# EAGLE design Washer Machine Status Inland ESP32 Through Hole (EAGLE 9.6.2)
AUTHOR: Eric Snis; REV: 1
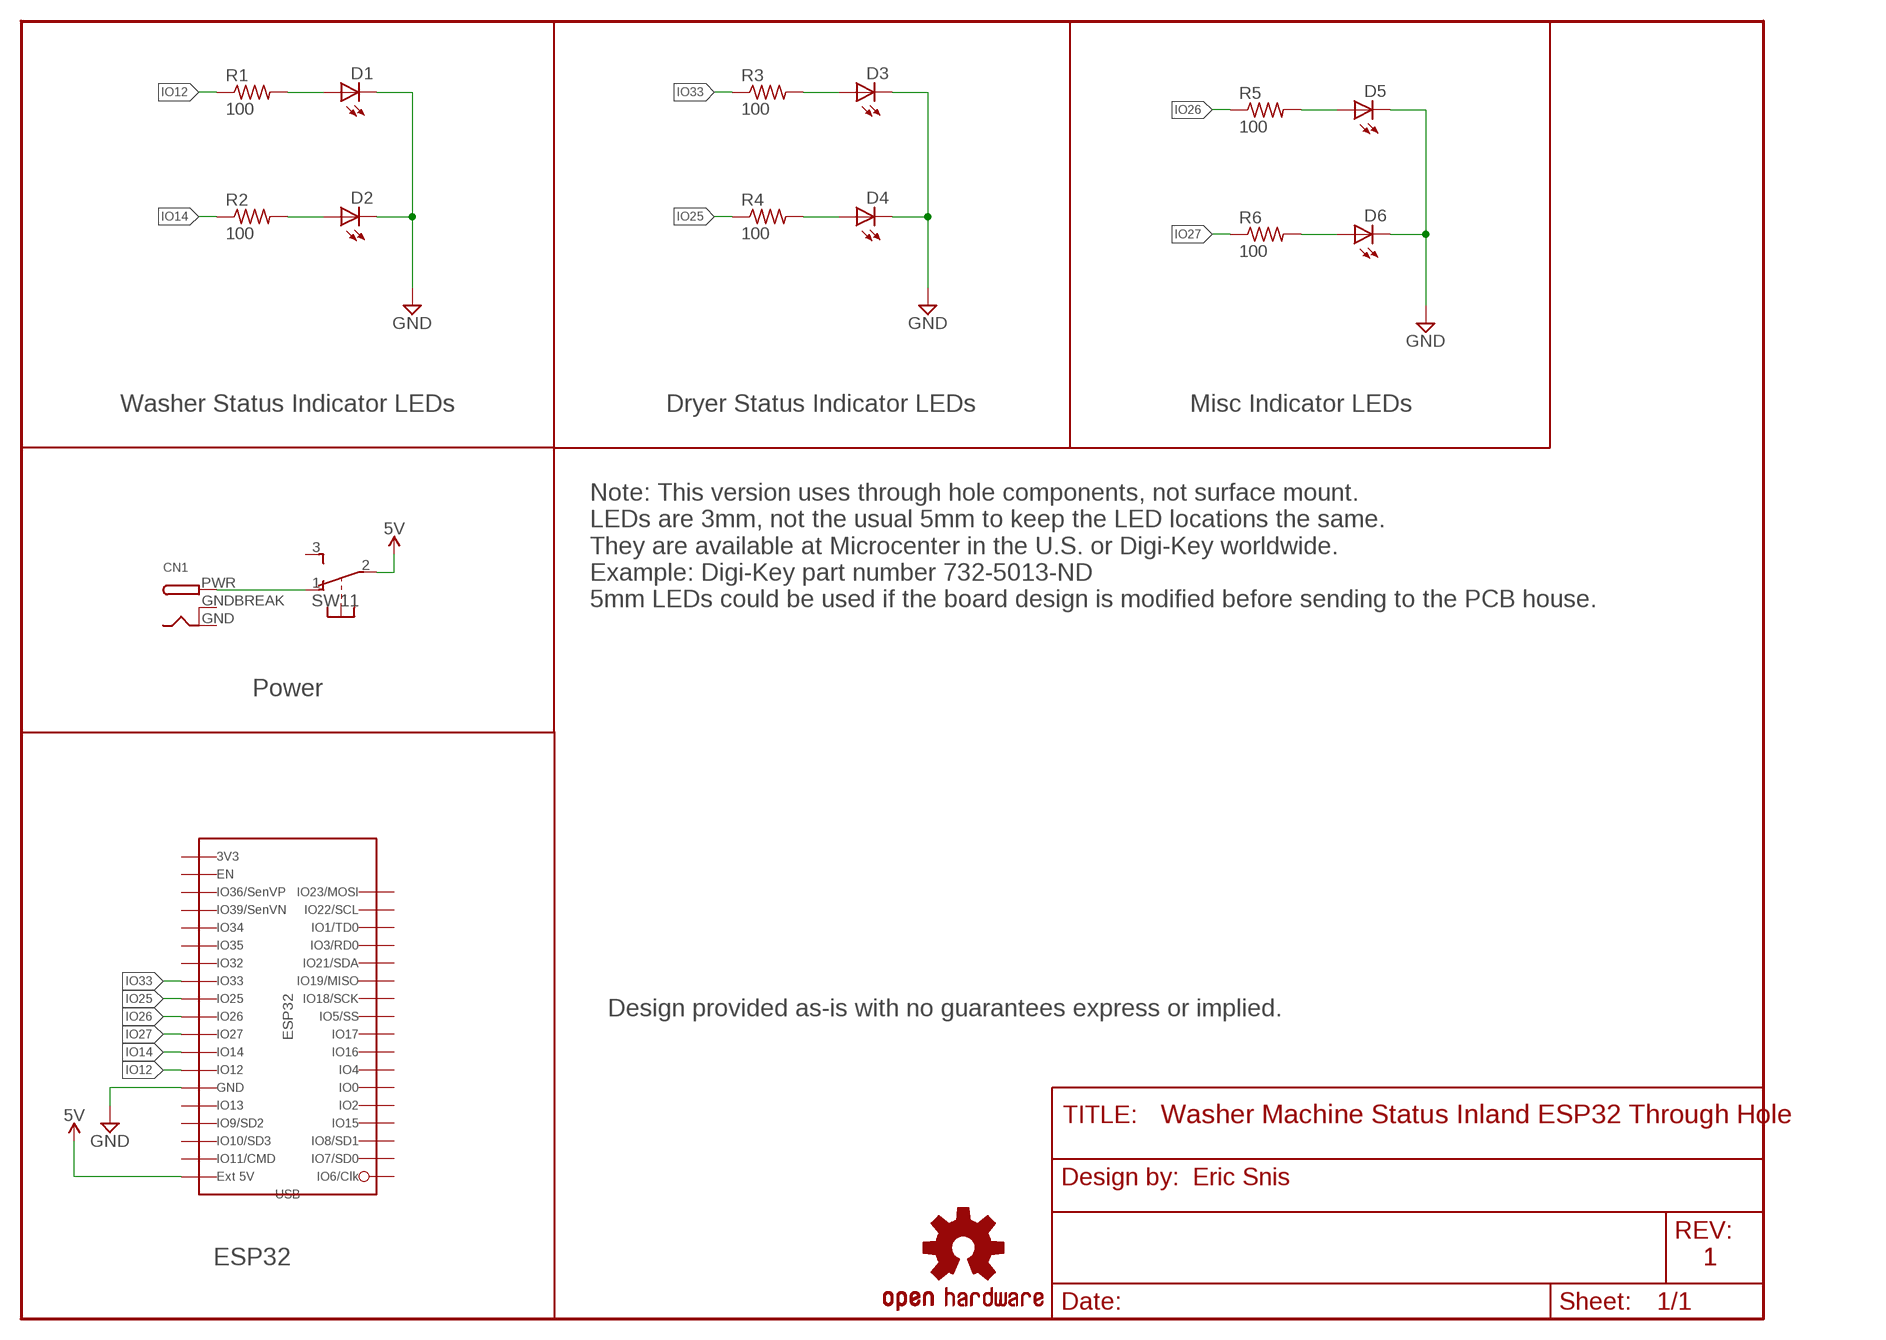
[diagram p0: schematic, sheet 1]

## Parts
CN1  DCBARRELPTH  [DCJACK_2MM_PTH]
D1  Green  LED3MM  [LED3MM]
D2  Red  LED3MM  [LED3MM]
D3  Green  LED3MM  [LED3MM]
D4  Red  LED3MM  [LED3MM]
D5  Green  LED3MM  [LED3MM]
D6  Red  LED3MM  [LED3MM]
LOGO2  OSHW-LOGOMINI  [OSHW-LOGO-MINI]
R1  100  R-US_0204/7  [0204/7]
R2  100  R-US_0204/7  [0204/7]
R3  100  R-US_0204/7  [0204/7]
R4  100  R-US_0204/7  [0204/7]
R5  100  R-US_0204/7  [0204/7]
R6  100  R-US_0204/7  [0204/7]
SW1  EG1213  [EG1213]
U$3  ESP32-INLAND  [ESP32_INLAND]

## Nets
5V: SW1.2(1:P) U$3.5V(EXT_5V)
GND: D1.K(C) D2.K(C) D3.K(C) D4.K(C) D5.K(C) D6.K(C) U$3.GND1 U$3.GND2(GND1) U$3.GND(GND1)
IO12: R1.1 U$3.IO12
IO14: R2.1 U$3.IO14
IO25: R4.1 U$3.IO25
IO26: R5.1 U$3.IO26
IO27: R6.1 U$3.IO27
IO33: R3.1 U$3.IO33
N$1: CN1.PWR SW1.1(1:O)
N$2: D5.A R5.2
N$3: D1.A R1.2
N$4: D2.A R2.2
N$5: D3.A R3.2
N$6: D4.A R4.2
N$7: D6.A R6.2
Unconnected: SW1.3(1:S) SW1.MT1(MT) SW1.MT2(MT) U$3.CLK U$3.CMD(IO11/CMD) U$3.EN U$3.IO0 U$3.IO2 U$3.IO4 U$3.IO5 U$3.IO13 U$3.IO15 U$3.IO16 U$3.IO17 U$3.IO18 U$3.IO19 U$3.IO21(IO21/SDA) U$3.IO22 U$3.IO23(IO23/SCL) U$3.IO32 U$3.IO34 U$3.IO35 U$3.RXD0 U$3.SD0 U$3.SD1 U$3.SD2(IO9/SD2) U$3.SD3(IO10/SD3) U$3.SVN(IO39/SVN) U$3.SVP(IO36/SVP) U$3.TXD0

## Notes on the sheet
- Washer Status Indicator LEDs | Dryer Status Indicator LEDs | Misc Indicator LEDs
- Note: This version uses through hole components, not surface mount.
  LEDs are 3mm, not the usual 5mm to keep the LED locations the same.
  They are available at Microcenter in the U.S. or Digi-Key worldwide.
  Example: Digi-Key part number 732-5013-ND
  5mm LEDs could be used if the board design is modified before sending to the PCB house.
- Power
- Design provided as-is with no guarantees express or implied.
- ESP32

## Power pins joined to a net without a drawn wire
3V3: U$3.3V3
GND: CN1.GND
GNDBREAK: CN1.GNDBREAK

## Library data of the parts
CN1 = connectors:DCBARREL: 2.0mm DC Barrel Jack DCJACK_2MM_PTH - Through Hole Jack (4UConnector: 05537)
D1-D6 = adafruit:LED: LED OSRAM: - CHIPLED LG R971, LG N971, LY N971, LG Q971, LY Q971, LO R971, LY R971 LH N974, LH R974 LS Q976, LO Q976, LY Q976 LO Q996 - Hyper CHIPLED LW Q18S LB Q993, LB Q99A, LB R99A - SideLED LS A670, LO A670, LY A670, LG A670, LP A670 LB A673, LV A673, LT A673, LW A673 LH A674 LY A675 LS A676, LA A676, LO A676, LY A676, LW A676 LS A679, LY A679, LG A679 - Hyper Micro SIDELED® LS Y876, LA Y876, LO Y876, LY Y876 LT Y87S - SmartLED LW L88C, LW L88S LB L89C, LB L89S, LG L890 LS L89K, LO L89K, LY L89K LS L896, LA L896, LO L896, LY L896 - TOPLED LS T670, LO T670, LY T670, LG T670, LP T670 LSG T670, LSP T670, LSY T670, LOP T670, LYG T670 LG T671, LOG T671, LSG T671 LB T673, LV T673, LT T673, LW T673 LH T674 LS T676, LA T676, LO T676, LY T676, LB T676, LH T676, LSB T676, LW T676 LB T67C, LV T67C, LT T67C, LS T67K, LO T67K, LY T67K, LW E67C LS E67B, LA E67B, LO E67B, LY E67B, LB E67C, LV E67C, LT E67C LW T67C LS T679, LY T679, LG T679 LS T770, LO T770, LY T770, LG T770, LP T770 LB T773, LV T773, LT T773, LW T773 LH T774 LS E675, LA E675, LY E675, LS T675 LS T776, LA T776, LO T776, LY T776, LB T776 LHGB T686 LT T68C, LB T68C - Hyper Mini TOPLED® LB M676 - Mini TOPLED Santana® LG M470 LS M47K, LO M47K, LY M47K Source: http://www.osram.convergy.de/
LOGO2 = SparkFun-Aesthetics:OSHW-LOGO: Open-Source Hardware (OSHW) Logo This logo indicates the piece of hardware it is found on incorporates a OSHW license and/or adheres to the definition of open source hardware found here: http://freedomdefined.org/OSHW
R1-R6 = adafruit:R-US_: RESISTOR, American symbol
SW1 = adafruit:EG1213: E-Switch right-angle slide SPDT Part #EG1213 http://www.ladyada.net/library/eagle
U$3 = connectors:ESP32: ESP-32-Dev ESP32 from Inland/Microcenter

## Board
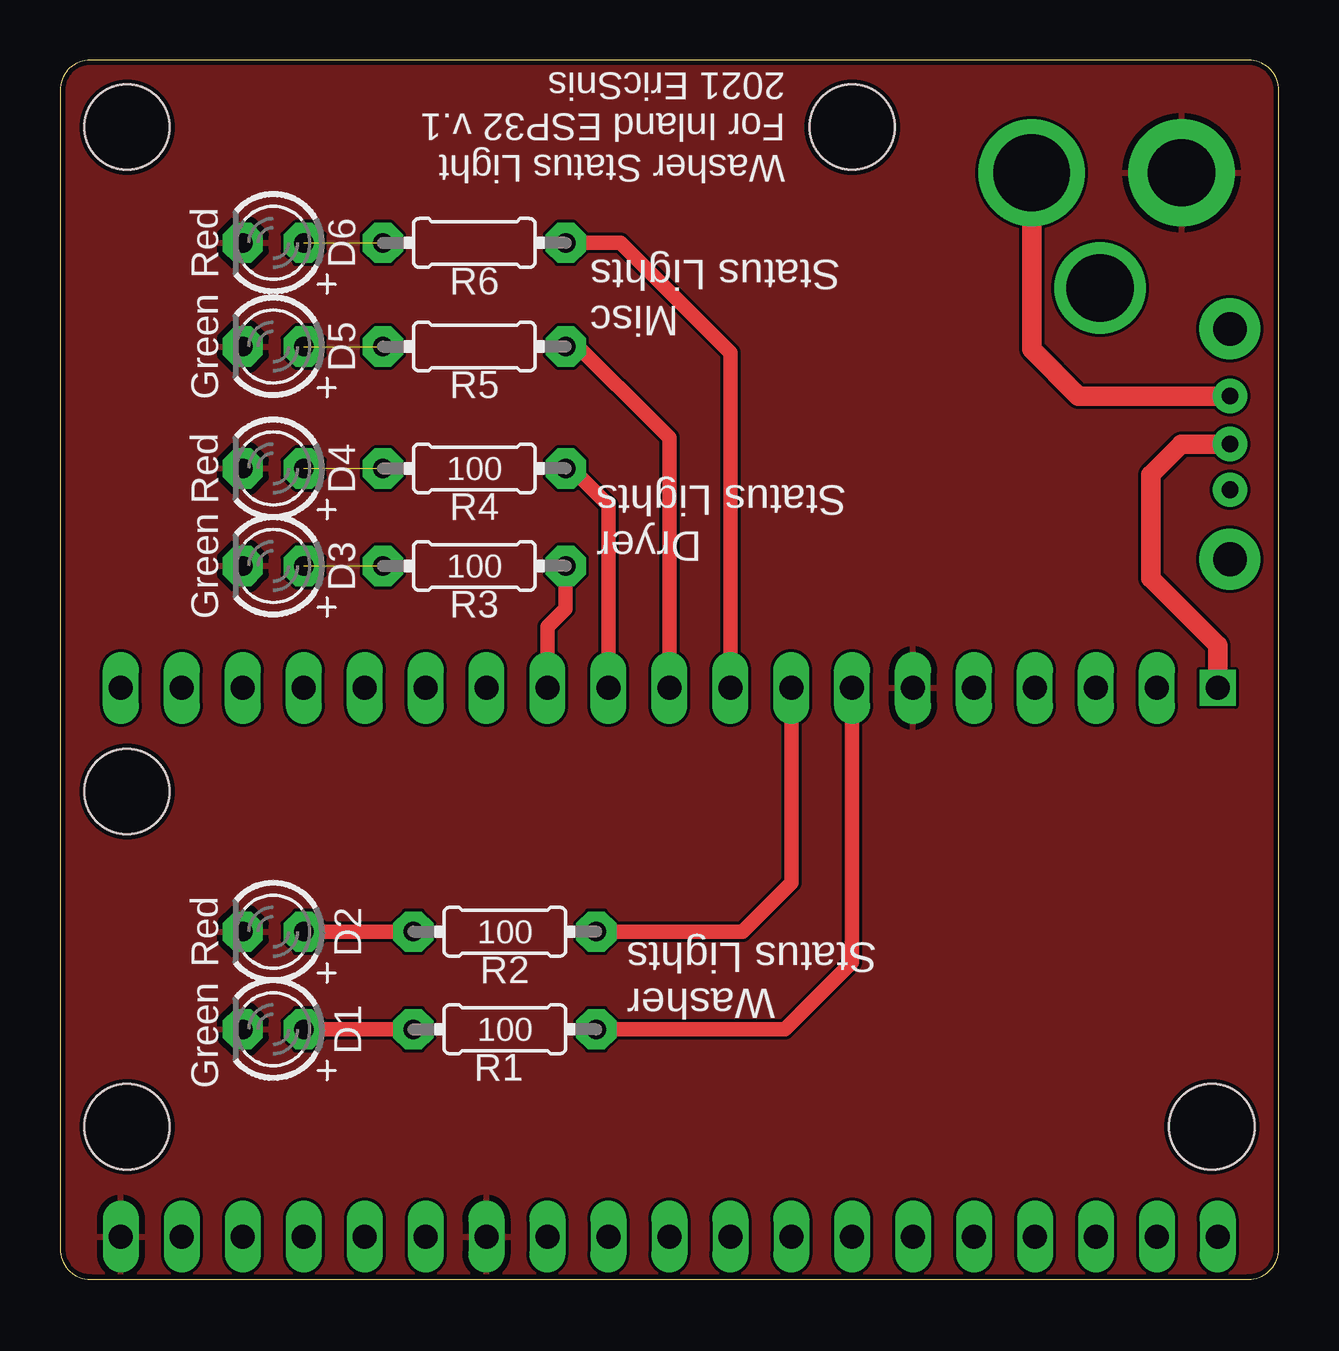
[diagram p1: board, top side]
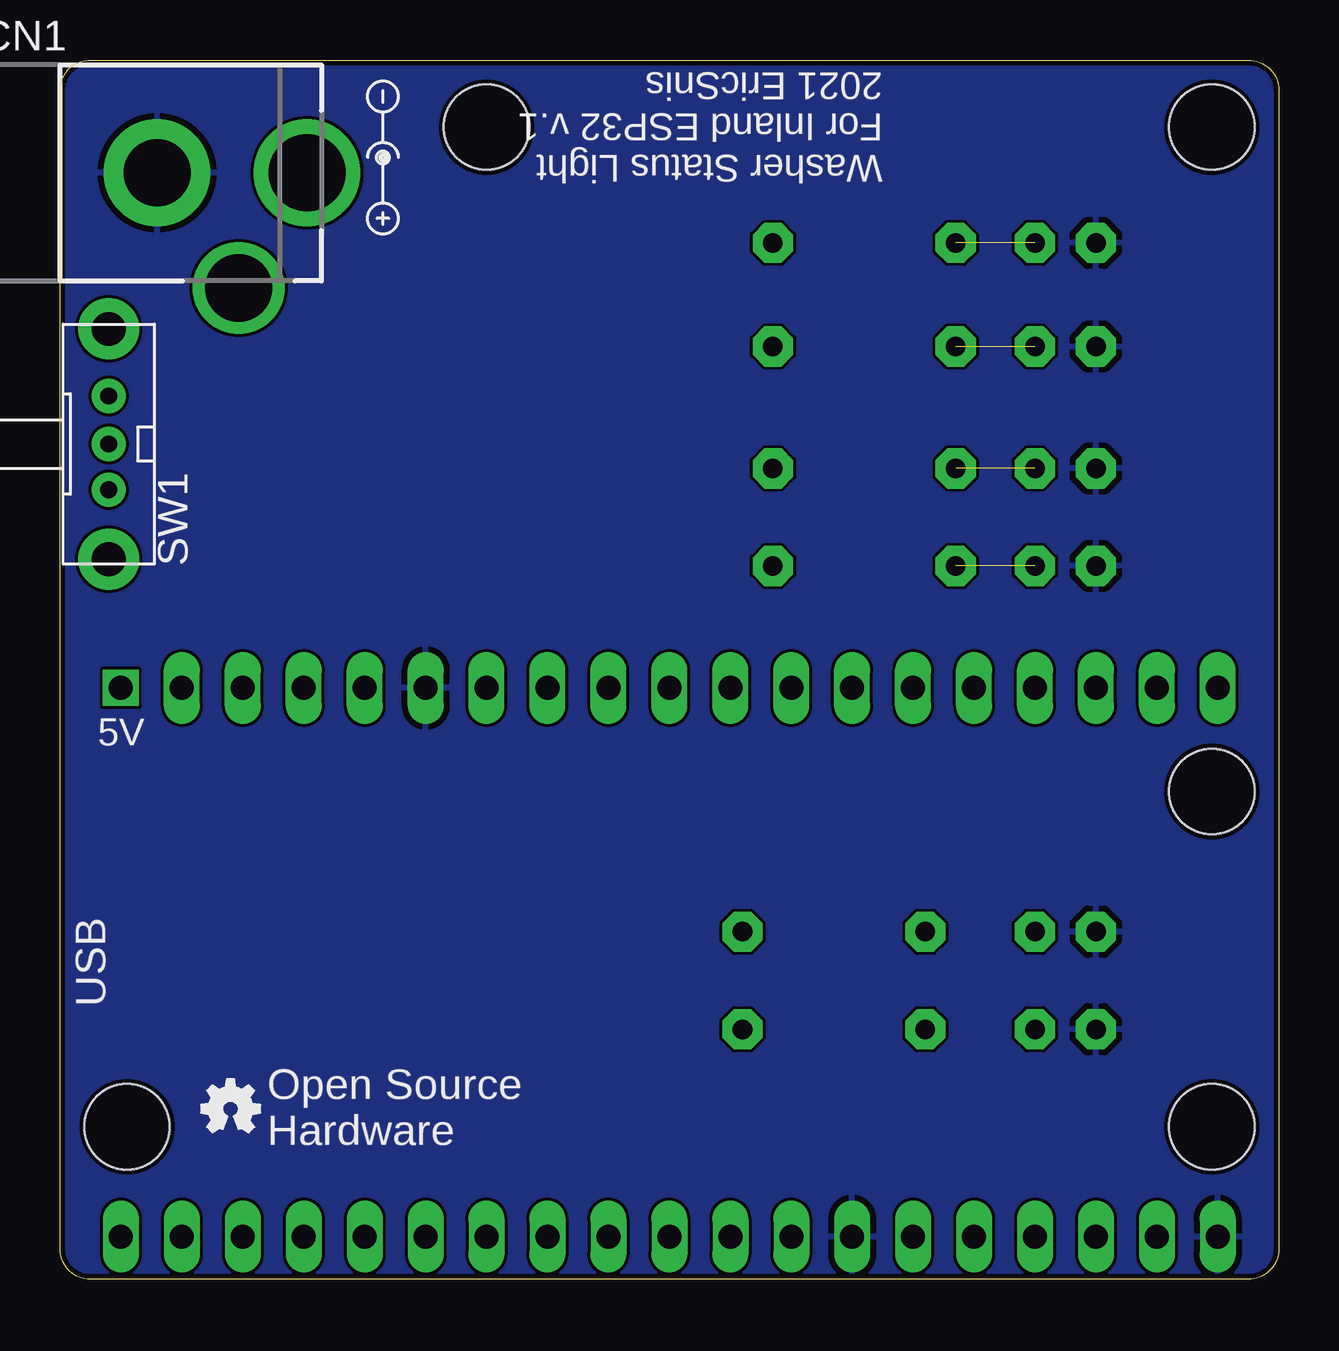
[diagram p2: board, bottom side, seen from below]

Size 50.8 x 50.8 mm. Coordinates in mm from the lower left corner, seen from the top.
Outline: 50.8,1.27 50.8,49.53 arc90 49.53,50.8 1.27,50.8 arc90 0,49.53 0,1.27 arc90 1.27,0 49.53,0 arc90 50.8,1.27
Copper layers (1*16): Top 0.035559375mm / dielectric 1.6mm / Bottom 0.035559375mm
Design rules "Digikey DKRed": minimum track width 5mil, minimum drill 8mil, track to track 5mil, track to pad 5mil, pad to pad 5mil, via to via 5mil, smd to smd 5mil, copper to edge 8mil, drill to drill 6mil, minimum pad ring 5mil, minimum via ring 3mil, stop-mask expansion 2.5mil, vias tented up to drill 0mil, thermal gap 10mil
Holes 3.56 mm at 2.79,6.35 48.01,6.35 2.79,20.32 2.79,48.01 33.02,48.01

### Footprints (pad centres in the part's own frame; a part is rotated, then mirrored left to right if it is on the bottom)
DCJACK_2MM_PTH = drill 2.8 pad 4.445: GND 0,7.35 | drill 2.8: GNDBREAK 4.8,10.75 | drill 3.2 pad 4.445: PWR 0,13.6
LED3MM = drill 0.813 pad 1.676 octagon: A -1.27,0; K 1.27,0
0204/7 = drill 0.813 pad 1.676 octagon: 1 -3.81,0; 2 3.81,0
EG1213 = drill 0.7 pad 1.422: 1 -2,0; 2 0,0; 3 1.9,0 | drill 1.4 pad 2.54: MT1 -4.8,0; MT2 4.8,0
ESP32_INLAND = drill 1 long: 3V3 11.43,-22.86; CLK -11.43,22.86; CMD 11.43,20.32; EN 11.43,-20.32; GND 11.43,10.16; GND1 -11.43,-22.86; GND2 -11.43,-7.62; IO0 -11.43,10.16; IO2 -11.43,12.7; IO4 -11.43,7.62; IO5 -11.43,0; IO12 11.43,7.62; IO13 11.43,12.7; IO14 11.43,5.08; IO15 -11.43,15.24; IO16 -11.43,5.08; IO17 -11.43,2.54; IO18 -11.43,-2.54; IO19 -11.43,-5.08; IO21 -11.43,-10.16; IO22 -11.43,-17.78; IO23 -11.43,-20.32; IO25 11.43,-2.54; IO26 11.43,0; IO27 11.43,2.54; IO32 11.43,-7.62; IO33 11.43,-5.08; IO34 11.43,-12.7; IO35 11.43,-10.16; RXD0 -11.43,-12.7; SD0 -11.43,20.32; SD1 -11.43,17.78; SD2 11.43,15.24; SD3 11.43,17.78; SVN 11.43,-15.24; SVP 11.43,-17.78; TXD0 -11.43,-15.24 | drill 1 square: 5V 11.43,22.86

### Placement (x,y rotation side)
CN1  54.1,46.1 270 bottom
D1  8.89,10.41 180 top
D2  8.89,14.48 180 top
D3  8.89,29.72 180 top
D4  8.89,33.78 180 top
D5  8.89,38.86 180 top
D6  8.89,43.18 180 top
LOGO2  43.69,7.11 0 bottom
R1  18.54,10.41 180 top
R2  18.54,14.48 180 top
R3  17.27,29.72 180 top
R4  17.27,33.78 180 top
R5  17.27,38.86 180 top
R6  17.27,43.18 180 top
SW1  48.77,34.8 270 bottom
U$1  [CENTER-POS-SMALL]  37.34,46.74 90 bottom
U$3  25.4,13.21 90 bottom

### Tracks (layer width: path | path; a pad name or v marks a point on that pad's centre or on a via)
5V
  Top 0.813: U$3.5V 48.26,26.42 45.47,29.21 45.47,33.53 46.74,34.8 SW1.2
GND
  pour Top (isolate 0.001): 50.8,1.27 50.8,49.53 arc90 49.53,50.8 1.27,50.8 arc90 0,49.53 0,1.27 arc90 1.27,0 49.53,0 arc90
  pour Bottom (isolate 0.001): 50.8,1.27 50.8,49.53 arc90 49.53,50.8 1.27,50.8 arc90 0,49.53 0,1.27 arc90 1.27,0 49.53,0 arc90
IO12
  Top 0.61: U$3.IO12 33.02,13.21 30.23,10.41 R1.1
IO14
  Top 0.61: U$3.IO14 30.48,16.51 28.45,14.48 R2.1
IO25
  Top 0.61: R4.1 21.08,34.04 22.86,32.26 U$3.IO25
IO26
  Top 0.61: U$3.IO26 25.4,35.05 21.08,39.37 R5.1
IO27
  Top 0.61: U$3.IO27 27.94,38.61 23.37,43.18 R6.1
IO33
  Top 0.61: U$3.IO33 20.32,27.18 21.08,27.94 R3.1
N$1
  Top 0.813: SW1.1 42.45,36.8 40.5,38.75 CN1.PWR
N$2  (1 unrouted)
N$3
  Top 0.61: R1.2 D1.A
N$4
  Top 0.61: R2.2 D2.A
N$5  (1 unrouted)
N$6  (1 unrouted)
N$7  (1 unrouted)

### Text on the board
tPlace: Washer Status Light / For Inland ESP32 v.1 / 2021 EricSnis | Misc / Status Lights | Dryer / Status Lights | Washer / Status Lights
bPlace: Washer Status Light / For Inland ESP32 v.1 / 2021 EricSnis | 5V | USB | Open Source / Hardware